# EAGLE design EveryCook_RaspiShield_V3 (EAGLE 6.4)
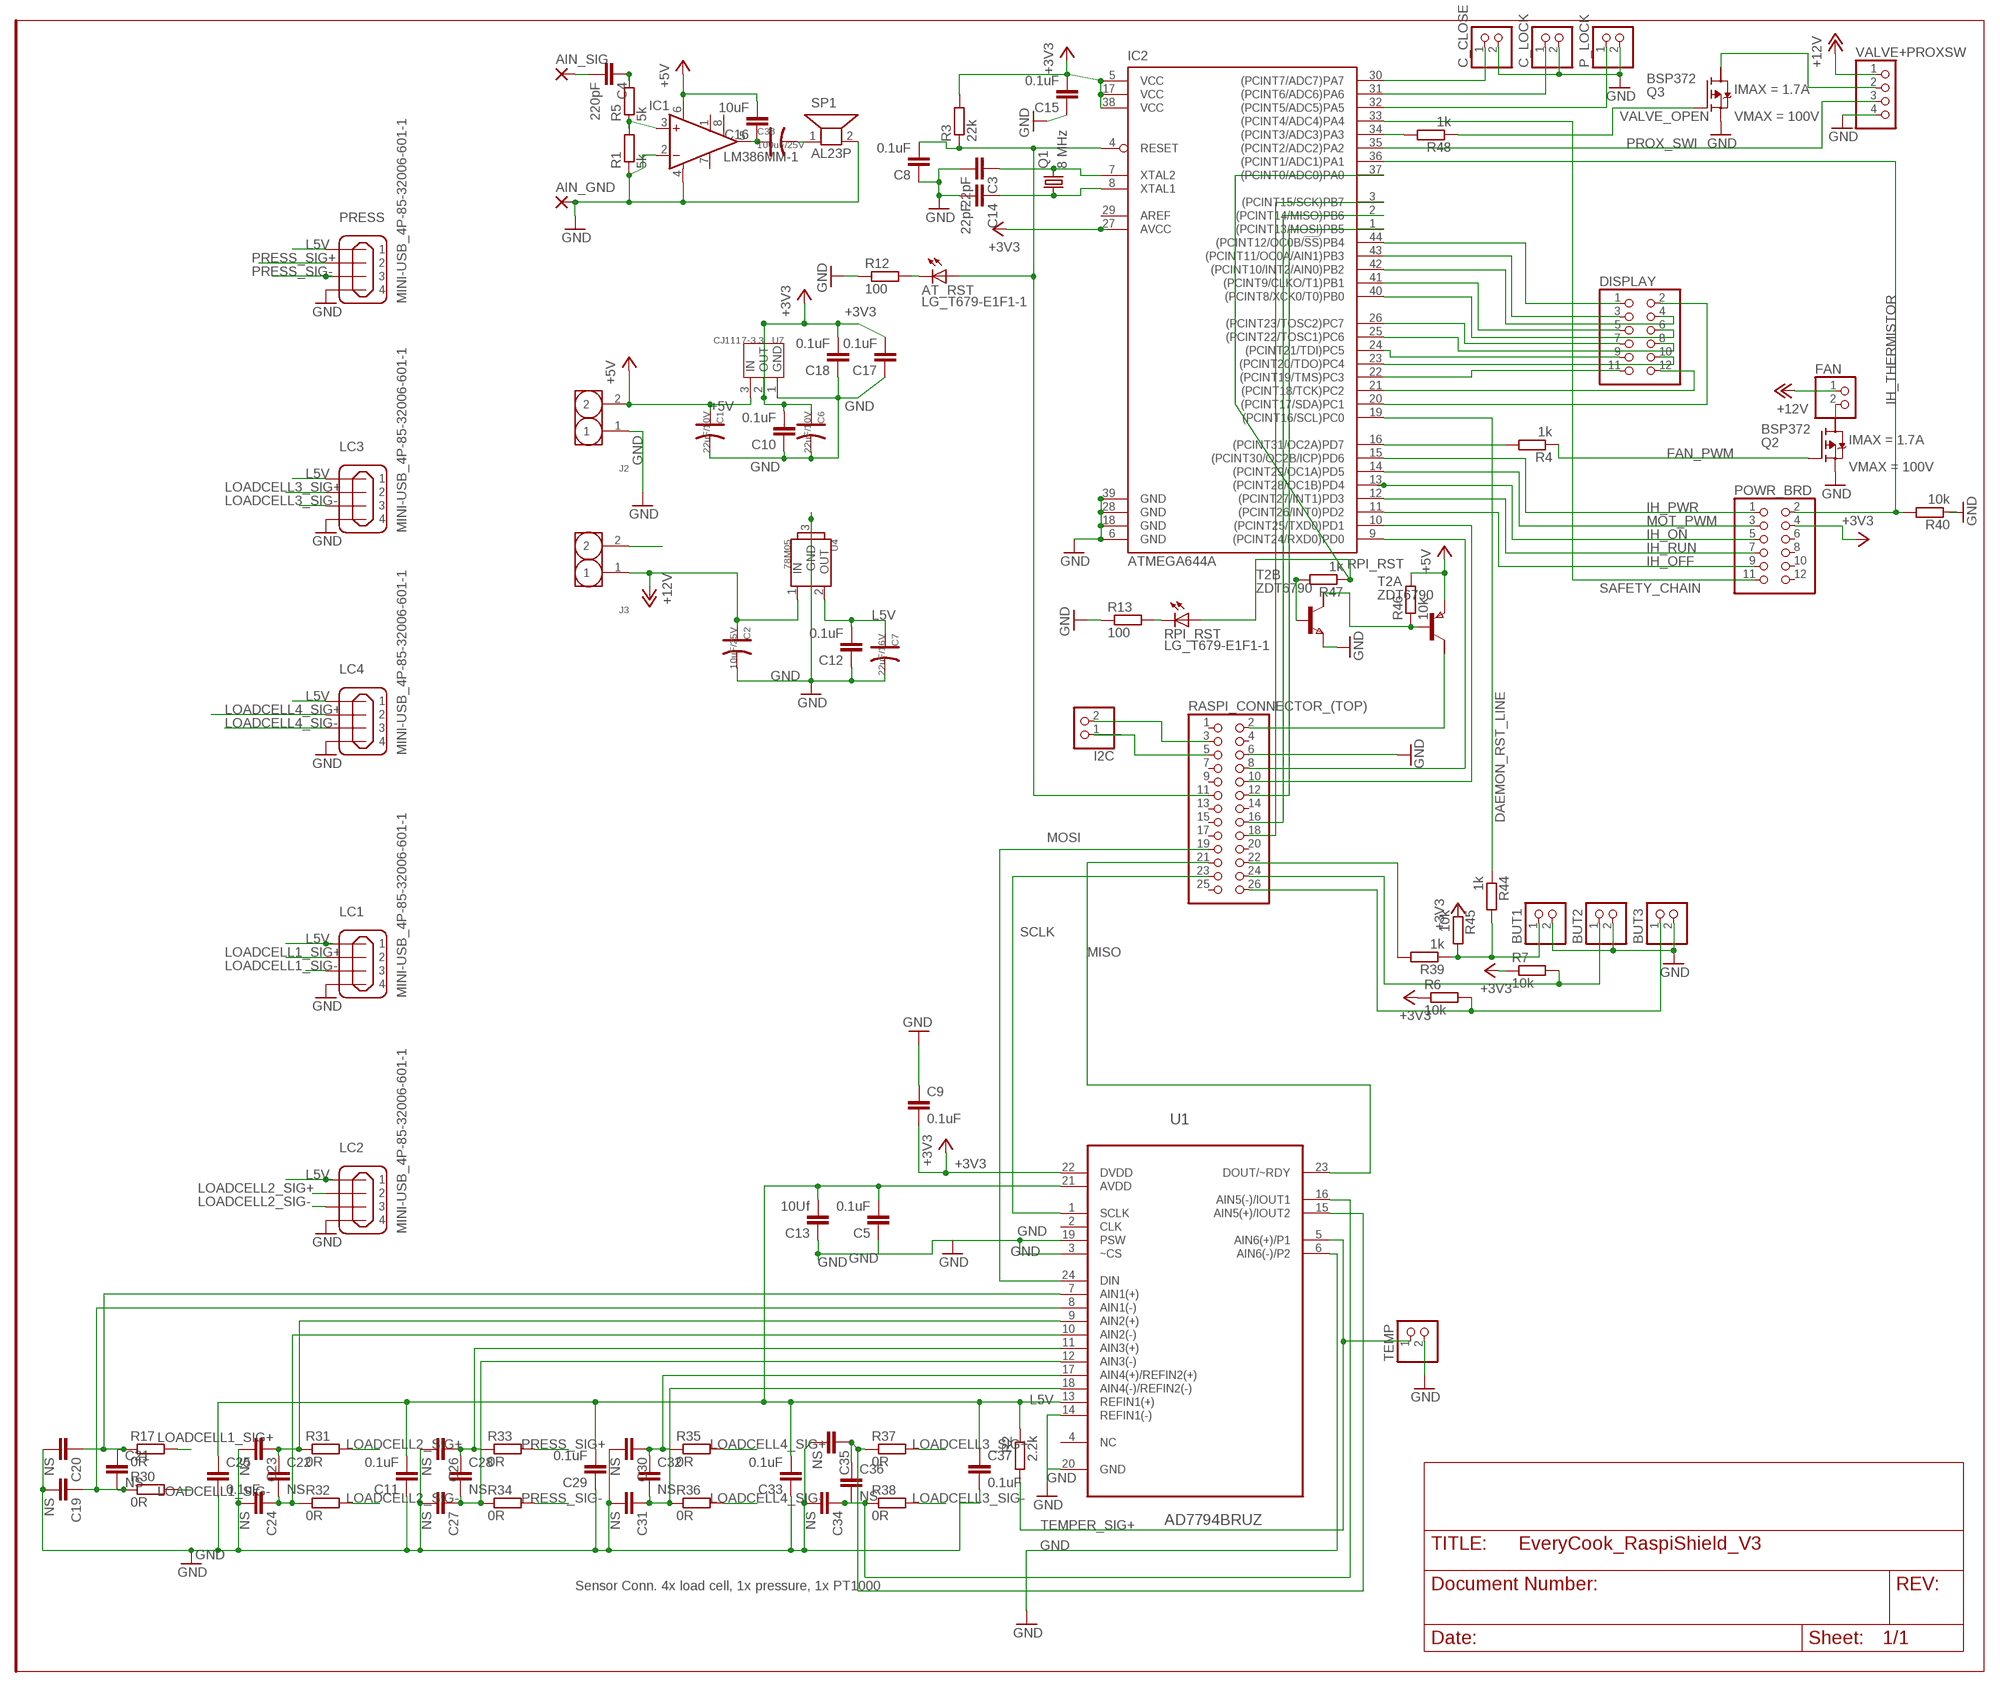
[diagram p0: schematic, sheet 1]

## Parts
AIN_GND  2,15/1,0  [2,15/1,0]
AIN_SIG  2,15/1,0  [2,15/1,0]
AT_RST  LG_T679-E1F1-1  [PLCC2]
BUT1  PINHD-1X2  [1X02]
BUT2  PINHD-1X2  [1X02]
BUT3  PINHD-1X2  [1X02]
C1  22uF/10V  CAP-AVX-A  [AVX-A]
C2  10uF/25V  CAP-ELECTRO-B  [ELECTRO-SMD-B-4.8MM]
C3  22pF  C-EUC0805  [C0805]
C4  220pF  C-EUC0805  [C0805]
C5  0.1uF  C-EUC0805  [C0805]
C6  22uF/10V  CAP-AVX-A  [AVX-A]
C7  22uF/16V  CAP-ELECTRO-B  [ELECTRO-SMD-B-4.8MM]
C8  0.1uF  C-EUC0805  [C0805]
C9  0.1uF  C-EUC0805  [C0805]
C10  0.1uF  C-EUC0805  [C0805]
C11  0.1uF  C-EUC0805  [C0805]
C12  0.1uF  C-EUC0805  [C0805]
C13  10Uf  C-EUC0805  [C0805]
C14  22pF  C-EUC0805  [C0805]
C15  0.1uF  C-EUC0805  [C0805]
C16  10uF  C-EUC0805  [C0805]
C17  0.1uF  C-EUC0805  [C0805]
C18  0.1uF  C-EUC0805  [C0805]
C19  NS  C-EUC0805  [C0805]
C20  NS  C-EUC0805  [C0805]
C21  NS  C-EUC0805  [C0805]
C22  NS  C-EUC0805  [C0805]
C23  NS  C-EUC0805  [C0805]
C24  NS  C-EUC0805  [C0805]
C25  0.1uF  C-EUC0805  [C0805]
C26  NS  C-EUC0805  [C0805]
C27  NS  C-EUC0805  [C0805]
C28  NS  C-EUC0805  [C0805]
C29  0.1uF  C-EUC0805  [C0805]
C30  NS  C-EUC0805  [C0805]
C31  NS  C-EUC0805  [C0805]
C32  NS  C-EUC0805  [C0805]
C33  0.1uF  C-EUC0805  [C0805]
C34  NS  C-EUC0805  [C0805]
C35  NS  C-EUC0805  [C0805]
C36  NS  C-EUC0805  [C0805]
C37  0.1uF  C-EUC0805  [C0805]
C38  100uF/25V  CAP-ELECTRO-B  [ELECTRO-SMD-B-4.8MM]
C_CLOSE  PINHD-1X2  [1X02]
C_LOCK  PINHD-1X2  [1X02]
DISPLAY  PINHD-2X6  [2X06]
FAN  PINHD-1X2  [1X02]
I2C  PINHD-1X2  [1X02]
IC1  LM386MM-1  [MMSOP08]
IC2  ATMEGA644A  [TQFP44]
J2  HEADER-2P-5.0  [2P-5.0]
J3  HEADER-2P-5.0  [2P-5.0]
LC1  MINI-USB_4P-85-32006-601-1  [85-32006-601-1]
LC2  MINI-USB_4P-85-32006-601-1  [85-32006-601-1]
LC3  MINI-USB_4P-85-32006-601-1  [85-32006-601-1]
LC4  MINI-USB_4P-85-32006-601-1  [85-32006-601-1]
P_LOCK  PINHD-1X2  [1X02]
POWR_BRD  PINHD-2X6  [2X06]
PRESS  MINI-USB_4P-85-32006-601-1  [85-32006-601-1]
Q1  8 MHz  CRYSTALHC49UP  [HC49UP]
Q2  BSP372  BSP613P  [PG-SOT-223]
Q3  BSP372  BSP613P  [PG-SOT-223]
R1  5k  R-EU_R0805  [R0805]
R2  2.2k  R-EU_R0805  [R0805]
R3  22k  R-EU_R0805  [R0805]
R4  1k  R-EU_R0805  [R0805]
R5  5k  R-EU_R0805  [R0805]
R6  10k  R-EU_R0805  [R0805]
R7  10k  R-EU_R0805  [R0805]
R12  100  R-EU_R0805  [R0805]
R13  100  R-EU_R0805  [R0805]
R17  0R  R-EU_R0805  [R0805]
R30  0R  R-EU_R0805  [R0805]
R31  0R  R-EU_R0805  [R0805]
R32  0R  R-EU_R0805  [R0805]
R33  0R  R-EU_R0805  [R0805]
R34  0R  R-EU_R0805  [R0805]
R35  0R  R-EU_R0805  [R0805]
R36  0R  R-EU_R0805  [R0805]
R37  0R  R-EU_R0805  [R0805]
R38  0R  R-EU_R0805  [R0805]
R39  1k  R-EU_R0805  [R0805]
R40  10k  R-EU_R0805  [R0805]
R44  1k  R-EU_R0805  [R0805]
R45  10k  R-EU_R0805  [R0805]
R46  10k  R-EU_R0805  [R0805]
R47  1k  R-EU_R0805  [R0805]
R48  1k  R-EU_R0805  [R0805]
RASPI_CONNECTOR_(TOP)  PINHD-2X13  [2X13]
RPI_RST  LG_T679-E1F1-1  [PLCC2]
SP1  AL23P  [AL23P]
T2  ZDT6790  NPN_PNPSM8  [SM8]
TEMP  PINHD-1X2  [1X02]
U1  AD7794BRUZ  [SOP65P640X120-24N]
U4  78M05  78M05-TO252  [TO252]
U7  CJ1117-3.3  LD1117SOT89  [SOT89]
VALVE+PROXSW  PINHD-1X4  [1X04]

## Nets
+3V3: C6.+ C9.2 C10.2 C15.2 C17.2 C18.2 IC2.5(VCC) IC2.17(VCC) IC2.27(AVCC) IC2.38(VCC) POWR_BRD.4 R3.2 R6.1 R7.1 R45.1 U1.22(DVDD) U7.2(OUT) U7.4(TAB)
+5V: C1.+ C16.2 IC1.6(VS) J2.2 R46.2 T2.1(A:E) U7.3(IN)
+12V: C2.+ FAN.1 J3.1 U4.1(IN) VALVE+PROXSW.1
ATMEL_RST: AT_RST.A C8.2 IC2.4(RESET) R3.1 RASPI_CONNECTOR_(TOP).11
DAEMON_RST_LINE: IC2.19((PCINT16/SCL)PC0) R44.1
FAN_PWM: Q2.1(G) R4.1
GND: AIN_GND.1(P) BUT1.2 BUT2.2 BUT3.2 C1.- C2.- C3.2 C5.1 C6.- C7.- C8.1 C9.1 C10.1 C11.1 C12.1 C13.1 C14.2 C15.1 C17.1 C18.1 C19.2 C20.2 C23.2 C24.2 C25.2 C26.2 C27.2 C29.1 C30.2 C31.2 C33.1 C34.2 C35.2 C37.2 C_CLOSE.2 C_LOCK.2 IC1.2(-IN) IC1.4(GND) IC2.6(GND) IC2.18(GND) IC2.28(GND) IC2.39(GND) J2.1 LC1.4 LC2.4 LC3.4 LC4.4 P_LOCK.2 PRESS.4 Q2.3(S) Q3.3(S) R1.1 R12.1 R13.1 R40.1 RASPI_CONNECTOR_(TOP).6 SP1.2 T2.3(B:E) TEMP.2 U1.3(~CS) U1.6(AIN6(-)/P2) U1.14(REFIN1(-)) U1.19(PSW) U1.20(GND) U4.3(GND) U7.1(GND) VALVE+PROXSW.4
IH_OFF: IC2.11((PCINT26/INT0)PD2) POWR_BRD.9
IH_ON: IC2.13((PCINT28/OC1B)PD4) POWR_BRD.5
IH_PWR: IC2.15((PCINT30/OC2B/ICP)PD6) POWR_BRD.1
IH_RUN: IC2.12((PCINT27/INT1)PD3) POWR_BRD.7
IH_THERMISTOR: IC2.36((PCINT1/ADC1)PA1) POWR_BRD.2 R40.2
L5V: C5.2 C7.+ C11.2 C12.2 C13.2 C25.1 C29.2 C33.2 C37.1 LC1.1 LC2.1 LC3.1 LC4.1 PRESS.1 R2.1 U1.13(REFIN1(+)) U1.21(AVDD) U4.2(OUT)
LOADCELL1_SIG+: LC1.2 R17.2
LOADCELL1_SIG-: LC1.3 R30.2
LOADCELL2_SIG+: LC2.2 R31.2
LOADCELL2_SIG-: LC2.3 R32.2
LOADCELL3_SIG+: LC3.2 R37.2
LOADCELL3_SIG-: LC3.3 R38.2
LOADCELL4_SIG+: LC4.2 R35.2
LOADCELL4_SIG-: LC4.3 R36.2
MISO: RASPI_CONNECTOR_(TOP).21 U1.23(DOUT/~RDY)
MOSI: RASPI_CONNECTOR_(TOP).19 U1.24(DIN)
MOT_PWM: IC2.14((PCINT29/OC1A)PD5) POWR_BRD.3
N$1: DISPLAY.2 IC2.20((PCINT17/SDA)PC1)
N$2: C3.1 IC2.7(XTAL2) Q1.2
N$3: C4.1 R5.2
N$5: C34.1 C36.2 R38.1 U1.16(AIN5(-)/IOUT1)
N$7: C14.1 IC2.8(XTAL1) Q1.1
N$8: IC2.3((PCINT15/SCK)PB7) RASPI_CONNECTOR_(TOP).18
N$9: C20.1 C21.1 R17.1 U1.7(AIN1(+))
N$10: IC2.16((PCINT31/OC2A)PD7) R4.2
N$11: DISPLAY.12 IC2.21((PCINT18/TCK)PC2)
N$12: I2C.2 RASPI_CONNECTOR_(TOP).3
N$14: IC1.3(+IN) R1.2 R5.1
N$15: DISPLAY.11 IC2.22((PCINT19/TMS)PC3)
N$16: DISPLAY.10 IC2.23((PCINT20/TDO)PC4)
N$17: DISPLAY.9 IC2.24((PCINT21/TDI)PC5)
N$18: DISPLAY.8 IC2.25((PCINT22/TOSC1)PC6)
N$19: DISPLAY.7 IC2.26((PCINT23/TOSC2)PC7)
N$22: C16.1 C38.+ IC1.5(OUT)
N$23: C38.- SP1.1
N$24: C22.1 C23.1 R31.1 U1.9(AIN2(+))
N$27: AIN_SIG.1(P) C4.2
N$32: AT_RST.C R12.2
N$34: R13.2 RPI_RST.C
N$37: DISPLAY.6 IC2.40((PCINT8/XCK0/T0)PB0)
N$38: DISPLAY.5 IC2.41((PCINT9/CLKO/T1)PB1)
N$39: DISPLAY.4 IC2.42((PCINT10/INT2/AIN0)PB2)
N$41: DISPLAY.3 IC2.43((PCINT11/OC0A/AIN1)PB3)
N$42: C22.2 C24.1 R32.1 U1.10(AIN2(-))
N$43: DISPLAY.1 IC2.44((PCINT12/OC0B/!SS!)PB4)
N$44: C27.1 C28.2 R34.1 U1.12(AIN3(-))
N$45: C30.1 C32.1 R35.1 U1.17(AIN4(+)/REFIN2(+))
N$46: C31.1 C32.2 R36.1 U1.18(AIN4(-)/REFIN2(-))
N$47: C35.1 C36.1 R37.1 U1.15(AIN5(+)/IOUT2)
N$48: C19.1 C21.2 R30.1 U1.8(AIN1(-))
N$50: I2C.1 RASPI_CONNECTOR_(TOP).5
N$51: FAN.2 Q2.2(D)
N$52: IC2.9((PCINT24/RXD0)PD0) RASPI_CONNECTOR_(TOP).8
N$53: C26.1 C28.1 R33.1 U1.11(AIN3(+))
N$54: IC2.10((PCINT25/TXD0)PD1) RASPI_CONNECTOR_(TOP).10
N$55: IC2.2((PCINT14/MISO)PB6) RASPI_CONNECTOR_(TOP).16
N$56: IC2.1((PCINT13/MOSI)PB5) RASPI_CONNECTOR_(TOP).12
N$58: RASPI_CONNECTOR_(TOP).2 T2.8(A:C1)
N$59: C_CLOSE.1 IC2.30((PCINT7/ADC7)PA7)
N$60: C_LOCK.1 IC2.31((PCINT6/ADC6)PA6)
N$61: IC2.32((PCINT5/ADC5)PA5) P_LOCK.1
N$62: BUT2.1 R7.2 RASPI_CONNECTOR_(TOP).24
N$63: BUT3.1 R6.2 RASPI_CONNECTOR_(TOP).26
N$64: R39.2 RASPI_CONNECTOR_(TOP).22
N$65: IC2.34((PCINT3/ADC3)PA3) R48.2
N$66: BUT1.1 R39.1 R44.2 R45.2
N$71: R47.2 T2.4(B:B)
N$72: R46.1 T2.2(A:B) T2.5(B:C1)
N$77: Q3.2(D) VALVE+PROXSW.2
PGND: J3.2
PRESS_SIG+: PRESS.2 R33.2
PRESS_SIG-: PRESS.3 R34.2
PROX_SWI: IC2.35((PCINT2/ADC2)PA2) VALVE+PROXSW.3
RPI_RST: IC2.37((PCINT0/ADC0)PA0) R47.1 RPI_RST.A
SAFETY_CHAIN: IC2.33((PCINT4/ADC4)PA4) POWR_BRD.11
SCLK: RASPI_CONNECTOR_(TOP).23 U1.1(SCLK)
TEMPER_SIG+: R2.2 TEMP.1 U1.5(AIN6(+)/P1)
VALVE_OPEN: Q3.1(G) R48.1
Unconnected: IC1.1(GAIN) IC1.7(BYPASS) IC1.8(GAIN) IC2.29(AREF) POWR_BRD.6 POWR_BRD.8 POWR_BRD.10 POWR_BRD.12 Q2.4(D) Q3.4(D) RASPI_CONNECTOR_(TOP).1 RASPI_CONNECTOR_(TOP).4 RASPI_CONNECTOR_(TOP).7 RASPI_CONNECTOR_(TOP).9 RASPI_CONNECTOR_(TOP).13 RASPI_CONNECTOR_(TOP).14 RASPI_CONNECTOR_(TOP).15 RASPI_CONNECTOR_(TOP).17 RASPI_CONNECTOR_(TOP).20 RASPI_CONNECTOR_(TOP).25 T2.6(B:C2) T2.7(A:C) U1.2(CLK) U1.4(NC)

## Notes on the sheet
- Sensor Conn. 4x load cell, 1x pressure, 1x PT1000

## Library data of the parts
AIN_GND AIN_SIG = wirepad:2,15/1,0: THROUGH-HOLE PAD
AT_RST RPI_RST = led:*_T679-?-1: LC TOPLED® Low Current LED Source: http://catalog.osram-os.com .. LG_LS_LY_T679_OBS.pdf; COLOR: green
BUT1-BUT3 C_CLOSE C_LOCK FAN I2C P_LOCK TEMP = pinhead:PINHD-1X2: PIN HEADER
C1 C2 C6 C7 C38 = Discrete:CAP*: Electrolytic Capacitors,Tantalum Capacitors and Super Capacitors
C3-C5 C8-C37 = rcl:C-EU: CAPACITOR, European symbol
DISPLAY POWR_BRD = pinhead:PINHD-2X6: PIN HEADER
IC1 = linear:LM386?-*: Low Voltage Audio Power Amplifier Source: http://cache.national.com/ds/LM/LM386.pdf
IC2 = atmel:ATMEGA644: 8-bit Microcontroller with 64K Bytes In-System Programmable Flash Source: http://www.atmel.com/dyn/resources/prod_documents/doc2593.pdf; MPN: ATMEGA644PV-10AU; OC_FARNELL: 1455123; OC_NEWARK: 58M3748
J2 J3 = Connector:HEADER-2P
LC1-LC4 PRESS = con-cypressindustries:MINI-USB_4P-: MINI USB 4 Pol. Source: www.cypressindustries.com; OC_FARNELL: unknown; OC_NEWARK: unknown
Q1 = crystal:CRYSTAL: CRYSTAL; OC_FARNELL: unknown; OC_NEWARK: unknown
Q2 Q3 = infineon:BSP613P: SIPMOS (R) Small-Signal-Transistor P-Channel (2 Drain) Source: http://www.infineon.com/dgdl/BSP613P_Rev2.4.pdf; IMAX: 1.7A; MF: Infineon; OC_FARNELL: unknown; OC_NEWARK: unknown; VMAX: 100V
R1-R7 R12 R13 R17 R30-R40 R44-R48 = rcl:R-EU_: RESISTOR, European symbol
RASPI_CONNECTOR_(TOP) = pinhead:PINHD-2X13: PIN HEADER
SP1 = buzzer:AL23P: SPEAKER Source: Buerklin; OC_FARNELL: unknown; OC_NEWARK: unknown
T2 = zetex:NPN_PNPSM8: Dual NPN TRANSISTOR; OC_FARNELL: unknown; OC_NEWARK: unknown
U1 = analog-devices:AD7794BRUZ: 6-Channel, Low Noise, Low Power, 24-/16-Bit Ó-Ä ADC with On-Chip In-Amp and Reference; MPN: AD7794BRUZ; OC_FARNELL: 1078329; OC_NEWARK: 19M0899; PACKAGE: TSSOP-24; SUPPLIER: Analog Devices
U4 = IC:78M05: 0.5A Three Terminal Positive Voltage Regulators http://pdf1.alldatasheet.com/datasheet-pdf/view/31368/TOSHIBA/78M05/+21_79UPLRhpDDdCDytD+/datasheet.pdf
U7 = IC:LD1117: Low Drop Fixed And Adjustable Positive Voltage Regulators http://www.datasheetcatalog.org/datasheet/SGSThomsonMicroelectronics/mXuqtqv.pdf
VALVE+PROXSW = pinhead:PINHD-1X4: PIN HEADER

## Board
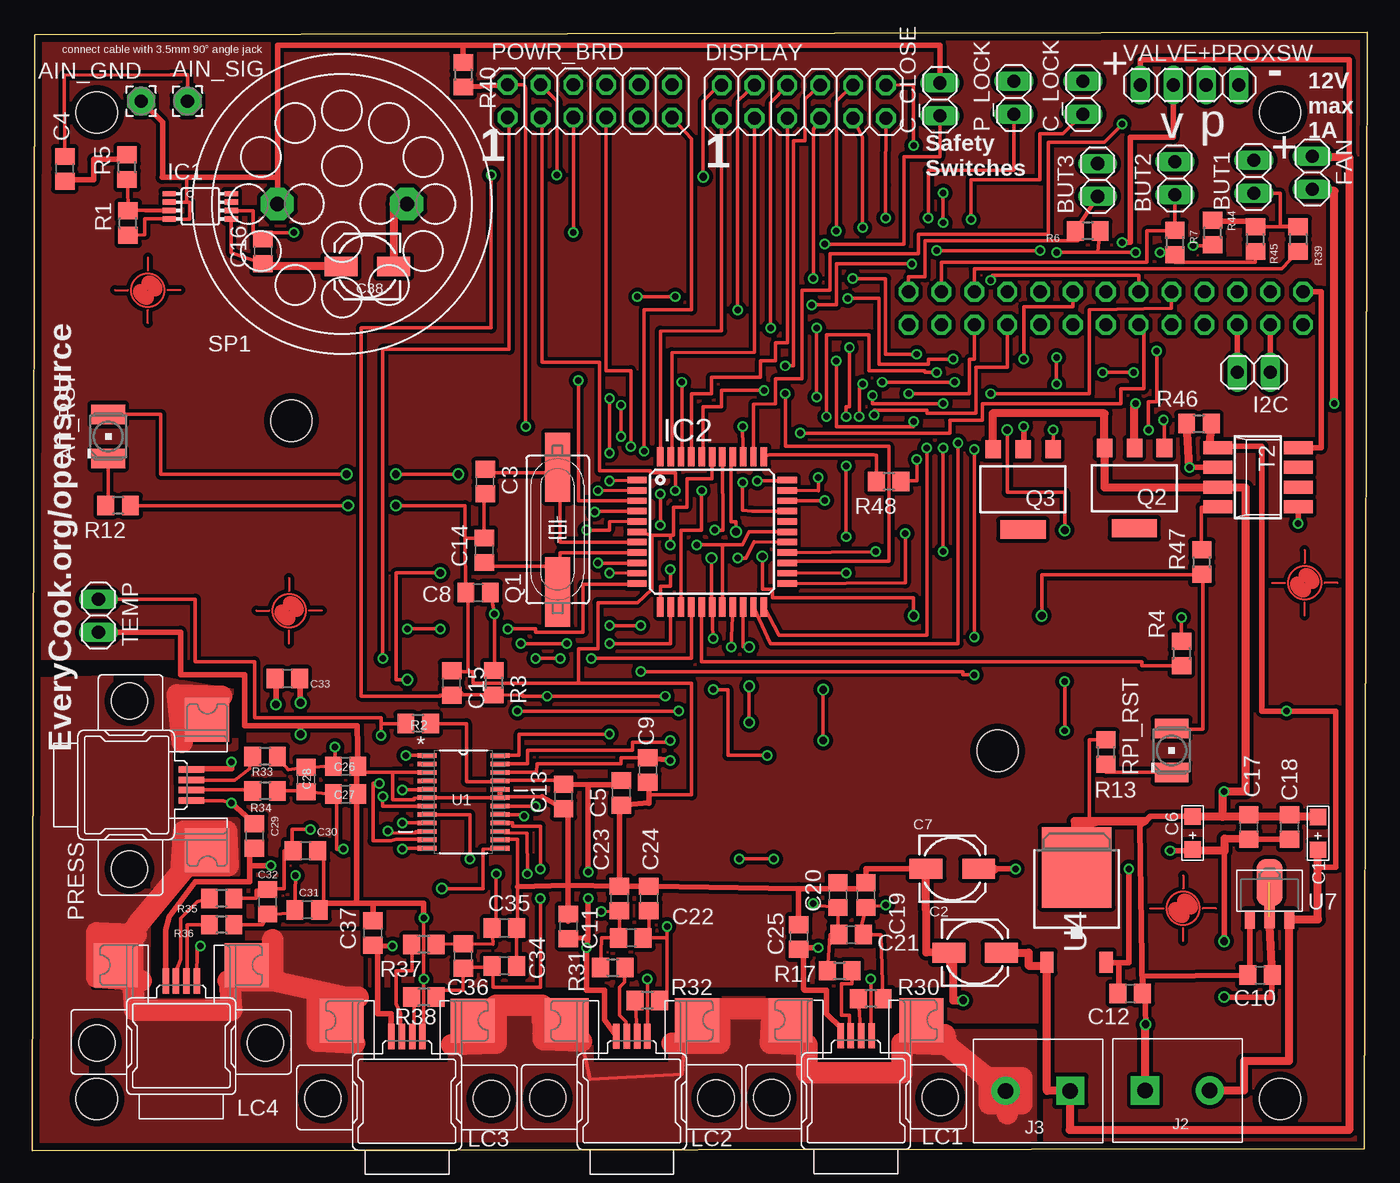
[diagram p1: board, top side]
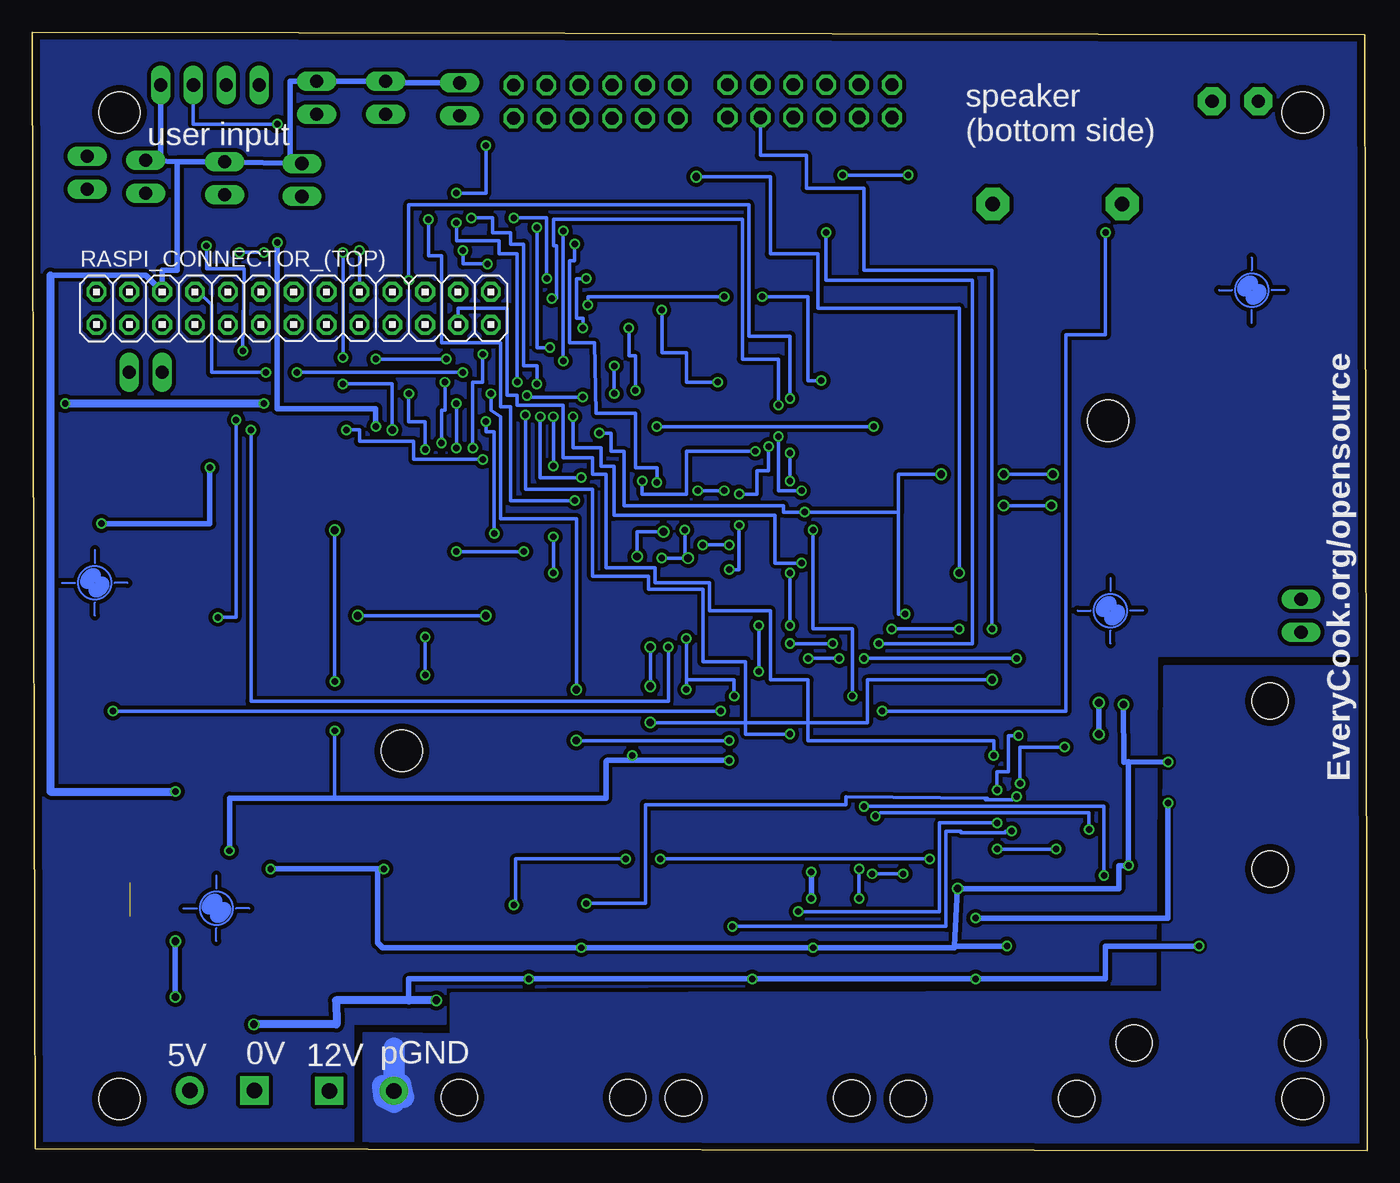
[diagram p2: board, bottom side, seen from below]

Size 103.15 x 86.39 mm. Coordinates in mm from the lower left corner, seen from the top.
Outline: 0.2,86.18 103.15,86.39 102.92,0.13 0,0 0.2,86.18
Copper layers (1*16): Top 0.035mm / dielectric 1.5mm / Bottom 0.035mm
Design rules "default *": minimum track width 7mil, minimum drill 12mil, track to track 8mil, track to pad 8mil, pad to pad 8mil, via to via 8mil, smd to smd 0mil, copper to edge 20mil, drill to drill 10mil, minimum pad ring 10mil, minimum via ring 6mil, stop-mask expansion 2mil, vias tented up to drill 25mil, thermal gap 10mil
Holes 3.2 mm at 74.6,30.89 20.02,56.39 4.98,80.19 4.98,3.99 96.42,3.99 96.42,80.19

### Footprints (pad centres in the part's own frame; a part is rotated, then mirrored left to right if it is on the bottom)
2,15/1,0 = drill 1.016 pad 2.159 octagon: 1 0,0
PLCC2 = smd 2.6 x 1.5: A 0,1.7; C 0,-1.7
1X02 = drill 1.016 long: 1 -1.27,0; 2 1.27,0
AVX-A = smd 1.27 x 1.27: + -1.27,0; - 1.27,0
ELECTRO-SMD-B-4.8MM = smd 2.54 x 1.524: + 2.032,0; - -2.032,0
C0805 = smd 1.3 x 1.5: 1 -0.95,0; 2 0.95,0
2X06 = drill 1.016 octagon: 1 -6.35,-1.27; 2 -6.35,1.27; 3 -3.81,-1.27; 4 -3.81,1.27; 5 -1.27,-1.27; 6 -1.27,1.27; 7 1.27,-1.27; 8 1.27,1.27; 9 3.81,-1.27; 10 3.81,1.27; 11 6.35,-1.27; 12 6.35,1.27
MMSOP08 = smd 0.41 x 1.02: 1 -0.975,-2.4; 2 -0.325,-2.4; 3 0.325,-2.4; 4 0.975,-2.4; 5 0.975,2.4; 6 0.325,2.4; 7 -0.325,2.4; 8 -0.975,2.4
TQFP44 = smd 1.5 x 0.5: 1 -5.8,4; 2 -5.8,3.2; 3 -5.8,2.4; 4 -5.8,1.6; 5 -5.8,0.8; 6 -5.8,0; 7 -5.8,-0.8; 8 -5.8,-1.6; 9 -5.8,-2.4; 10 -5.8,-3.2; 11 -5.8,-4; 23 5.8,-4; 24 5.8,-3.2; 25 5.8,-2.4; 26 5.8,-1.6; 27 5.8,-0.8; 28 5.8,0; 29 5.8,0.8; 30 5.8,1.6; 31 5.8,2.4; 32 5.8,3.2; 33 5.8,4 | smd 0.5 x 1.5: 12 -4,-5.8; 13 -3.2,-5.8; 14 -2.4,-5.8; 15 -1.6,-5.8; 16 -0.8,-5.8; 17 0,-5.8; 18 0.8,-5.8; 19 1.6,-5.8; 20 2.4,-5.8; 21 3.2,-5.8; 22 4,-5.8; 34 4,5.8; 35 3.2,5.8; 36 2.4,5.8; 37 1.6,5.8; 38 0.8,5.8; 39 0,5.8; 40 -0.8,5.8; 41 -1.6,5.8; 42 -2.4,5.8; 43 -3.2,5.8; 44 -4,5.8
2P-5.0 = drill 1.2 pad 2.184 square: 1 0,0 | drill 1.2 pad 2.184: 2 5,0
85-32006-601-1 = smd 0.5 x 1.95: 1 -1.2,4.775; 2 -0.4,4.775; 3 0.4,4.775; 4 1.2,4.775 | smd 3.4 x 3.4: M1 -5.05,6; M2 5.05,6 | hole 2.8: -6.5,0; 6.5,0
HC49UP = smd 5.334 x 1.93: 1 -4.826,0; 2 4.826,0
PG-SOT-223 = smd 1.2 x 1.4: 1 -2.311,-3.099; 2 0,-3.099; 3 2.311,-3.099 | smd 3.5 x 1.4: 4 0,3.099
R0805 = smd 1.3 x 1.5: 1 -0.95,0; 2 0.95,0
2X13 = drill 1.016 octagon: 1 -15.24,-1.27; 2 -15.24,1.27; 3 -12.7,-1.27; 4 -12.7,1.27; 5 -10.16,-1.27; 6 -10.16,1.27; 7 -7.62,-1.27; 8 -7.62,1.27; 9 -5.08,-1.27; 10 -5.08,1.27; 11 -2.54,-1.27; 12 -2.54,1.27; 13 0,-1.27; 14 0,1.27; 15 2.54,-1.27; 16 2.54,1.27; 17 5.08,-1.27; 18 5.08,1.27; 19 7.62,-1.27; 20 7.62,1.27; 21 10.16,-1.27; 22 10.16,1.27; 23 12.7,-1.27; 24 12.7,1.27; 25 15.24,-1.27; 26 15.24,1.27
AL23P = drill 1.118 pad 2.54 octagon: 1 -5.004,0; 2 5.004,0
SM8 = smd 1.016 x 2.235: 1 -2.286,-3.099; 2 -0.762,-3.099; 3 0.762,-3.099; 4 2.286,-3.099; 5 2.286,3.099; 6 0.762,3.099; 7 -0.762,3.099; 8 -2.286,3.099
SOP65P640X120-24N = smd 1.473 x 0.356: 1 -2.819,3.581; 2 -2.819,2.921; 3 -2.819,2.286; 4 -2.819,1.626; 5 -2.819,0.965; 6 -2.819,0.33; 7 -2.819,-0.33; 8 -2.819,-0.965; 9 -2.819,-1.626; 10 -2.819,-2.286; 11 -2.819,-2.921; 12 -2.819,-3.581; 13 2.819,-3.581; 14 2.819,-2.921; 15 2.819,-2.286; 16 2.819,-1.626; 17 2.819,-0.965; 18 2.819,-0.33; 19 2.819,0.33; 20 2.819,0.965; 21 2.819,1.626; 22 2.819,2.286; 23 2.819,2.921; 24 2.819,3.581
TO252 = smd 1.016 x 1.651: 1 -2.286,-4.826; 2 2.286,-4.826 | smd 5.4 x 6.2: 3 0,2.5
SOT89 = smd 0.8 x 1.4: 1 -1.524,-1.905; 3 1.524,-1.905 | smd 0.8 x 1.9: 2 0,-1.651 | smd 2.032 x 3.65: 4 0,0.94
1X04 = drill 1.016 long: 1 -3.81,0; 2 -1.27,0; 3 1.27,0; 4 3.81,0

### Placement (x,y rotation side)
AIN_GND  8.41,81.08 180 top
AIN_SIG  11.99,81.08 180 top
AT_RST  5.87,55.17 0 top
BUT1  94.39,75.23 90 top
BUT2  88.29,75.11 90 top
BUT3  82.32,74.98 90 top
C1  99.34,24.51 90 top
C2  72.85,15.29 0 top
C3  35,51.69 270 top
C4  2.51,75.84 90 top
C5  45.51,27.64 90 top
C6  89.66,24.54 90 top
C7  71.09,21.77 0 top
C8  34.44,43.1 0 top
C9  47.57,29.4 90 top
C10  94.87,13.56 0 top
C11  41.43,17.32 270 top
C12  84.84,12.14 180 top
C13  41.05,27.36 90 top
C14  34.93,46.38 90 top
C15  32.41,36.12 270 top
C16  17.83,69.47 90 top
C17  94.01,24.99 270 top
C18  97.16,24.99 270 top
C19  64.41,19.74 90 top
C20  62.26,19.74 90 top
C21  63.27,16.69 0 top
C22  46.25,16.43 0 top
C23  45.36,19.48 90 top
C24  47.65,19.48 90 top
C25  59.23,16.51 90 top
C26  24.21,29.69 0 top
C27  24.21,27.53 0 top
C28  21.16,28.68 270 top
C29  17.17,24.31 270 top
C30  21.11,23.16 0 top
C31  21.23,18.59 0 top
C32  18.19,19.23 270 top
C33  19.71,36.47 180 top
C34  36.47,14.27 0 top
C35  36.47,17.2 0 top
C36  33.3,15.04 270 top
C37  26.31,16.81 90 top
C38  25.88,68.3 180 top
C_CLOSE  70.13,81.2 90 top
C_LOCK  81.18,81.33 90 top
DISPLAY  59.61,81.03 0 top
FAN  98.91,75.54 270 top
I2C  94.39,60.12 0 top
IC1  12.98,72.95 270 top
IC2  52.53,47.8 0 top
J2  85.99,4.65 0 top
J3  80.21,4.62 180 top
LC1  63.65,4.09 0 top
LC2  46.33,4.06 0 top
LC3  28.96,4.04 0 top
LC4  11.51,8.33 0 top
P_LOCK  75.84,81.33 90 top
POWR_BRD  43.08,81.08 0 top
PRESS  7.52,28.24 270 top
Q1  40.59,47.98 90 top
Q2  85.17,51.18 180 top
Q3  76.56,51.08 180 top
R1  7.39,71.65 90 top
R2  29.82,32.99 180 top
R3  35.66,36.14 270 top
R4  88.8,38.4 270 top
R5  7.32,75.97 90 top
R6  81.56,71.04 180 top
R7  88.29,70.15 90 top
R12  6.63,49.83 180 top
R13  82.96,30.78 270 top
R17  62.38,13.89 0 top
R30  64.8,11.73 180 top
R31  44.86,14.15 0 top
R32  47.52,11.61 180 top
R33  17.98,30.45 180 top
R34  17.98,27.79 180 top
R35  14.63,19.48 180 top
R36  14.63,17.45 180 top
R37  30.25,15.93 180 top
R38  30.25,11.86 180 top
R39  97.82,70.41 270 top
R40  33.3,83.11 270 top
R44  91.21,70.92 90 top
R45  94.51,70.41 90 top
R46  90.14,56.16 0 top
R47  90.37,45.47 90 top
R48  66.18,51.69 180 top
RASPI_CONNECTOR_(TOP)  82.96,65.07 0 bottom
RPI_RST  88.04,30.91 0 top
SP1  23.93,73.13 180 top
T2  94.72,52.02 270 top
TEMP  5.11,41.33 270 top
U1  33.32,26.94 0 top
U4  80.7,19.38 0 top
U7  95.61,19.76 0 top
U$1  [PASS-ROUND]  8.92,66.47 0 top
U$2  [PASS-ROUND]  19.84,41.71 0 top
U$3  [PASS-ROUND]  88.93,18.72 0 top
U$4  [PASS-ROUND]  98.32,43.87 0 top
VALVE+PROXSW  89.43,82.32 0 top

### Tracks (layer width: path | path; a pad name or v marks a point on that pad's centre or on a via)
+3V3  (via drill 0.5 pad 0.25, 0.6, 0.6 pad 0.25)  (1 unrouted)
  Top 0.254: POWR_BRD.4 40.54,81.08 v40.54,75.36 | v35.46,75.36 35.46,63.55 25.43,63.55 25.43,35.1 31.52,35.1 31.52,35.17 C15.2 32.41,35.38 33.17,35.38 33.17,35.23 34.82,35.23 34.82,35.19 R3.2 37.87,35.23 37.87,35.1 v39.78,35.1 v48.92,35.1 | R45.1 94.51,68.63 88.29,68.63 R7.1 v87.15,69.39 | v85.24,69.39 82.32,69.39 | R6.1 82.32,69.39 | 82.32,69.39 v79.15,69.39 | v79.15,61.26 v79.15,59.23 | v75.34,55.68 75.34,50.85 79.78,50.85 v79.78,47.93 | v79.78,36.25 v79.78,32.44 | IC2.17 v52.6,39.55 | v52.6,35.61 53.75,35.61 53.75,30.53 v56.79,30.53 | v54.51,45.77 55.14,45.77 55.78,47.04 IC2.27 | IC2.5 44.6,48.56 44.6,47.93 v42.82,47.93 | U1.22 38.98,29.22 39.01,29.9 45.49,29.9 45.49,30.35 C9.2 | IC2.38 53.37,47.93 v52.73,47.93 | IC2.17 52.6,42 | IC2.17 52.48,42 v52.48,45.77
  Top 0.406: C6.+ 89.56,23.16 v87.91,23.16 | v49.3,30.15 v49.29,30.16 C9.2 | C17.2 C18.2 | 92.13,23.16 92.1,23.16 v92.1,16.18 | v92.1,11.86 95.76,11.86 C10.2
  Top 0.61: C10.2 U7.2 | C17.2 92.13,24.1 92.13,23.16 89.66,23.16 C6.+
  Bottom 0.254: v40.54,75.36 v35.46,75.36 | v87.15,69.39 v85.24,69.39 | v79.15,69.39 v79.15,61.26 | v79.15,59.23 75.34,59.23 v75.34,55.68 | v79.78,47.93 v79.78,36.25 | v79.78,32.44 79.78,27.23 | v52.6,39.55 52.6,36.37 | 52.6,36.37 v52.6,35.61 | v56.79,30.53 56.79,30.15 52.6,30.15 | v42.82,47.93 42.82,40.31 39.78,40.31 v39.78,35.1 | 52.6,36.37 48.92,36.37 v48.92,35.1 | v52.48,45.77 v54.51,45.77 52.73,45.77 v52.73,47.93
  Bottom 0.406: v87.91,23.16 87.91,27.23 79.78,27.23 58.83,27.23 58.83,30.02 58.7,30.15 52.6,30.15 v49.3,30.15 | v92.1,16.18 v92.1,11.86
+5V  (via drill 0.5 pad 0.25)
  Top 0.254: IC1.6 17.07,72.62 17.07,70.87 C16.2 18.26,70.92 v20.22,70.92 | v37.49,33.96 v49.94,33.96
  Top 0.406: T2.1 91.62,54.41 95.02,54.41 95.02,33.96 v96.93,33.96 100.74,33.96 100.74,21.89 99.34,21.89
  Top 0.61: J2.2 93.65,4.65 93.65,6.93 97.13,6.93 U7.3 99.34,17.86 99.34,21.89 C1.+ | R46.2 90.91,54.3 T2.1
  Bottom 0.254: v20.22,70.92 20.22,63.04 23.27,63.04 23.27,33.96 v37.49,33.96 | v49.94,33.96 v96.93,33.96
+12V
  Top 0.406: FAN.1 98.93,76.76 | 80.16,1.57 80.21,1.75 | VALVE+PROXSW.1 85.62,84.25 101.75,84.25 101.75,76.76
  Top 0.61: C2.+ 76.99,15.29 76.99,14.3 78.41,14.3 U4.1 78.41,4.62 J3.1 80.21,1.75 | 98.93,76.76 101.75,76.76 101.75,1.57 80.16,1.57
ATMEL_RST  (via drill 0.5 pad 0.25, 0.6)
  Top 0.254: R3.1 35.71,36.96 v35.71,41.45 C8.2 | v43.46,49.33 43.92,49.4 IC2.4 | RASPI_CONNECTOR_(TOP).11 85.88,63.55 85.88,58.85 84.1,58.85 84.1,57.71 73.43,57.71 73.43,56.44 70.89,56.44 70.89,55.42 v59.33,55.42 | AT_RST.A 9.93,56.87 9.93,52.25 v24.28,52.25 | v28.09,52.25 v32.92,52.25
  Bottom 0.254: v35.71,41.45 36.22,41.45 36.22,49.33 | 36.22,49.33 v43.46,49.33 45.11,49.33 45.11,49.83 57.43,49.83 57.43,54.03 58.45,54.03 58.45,55.42 v59.33,55.42 | v24.28,52.25 v28.09,52.25 | v32.92,52.25 36.22,52.25 36.22,49.33
DAEMON_RST_LINE  (via drill 0.5 pad 0.25)
  Top 0.254: R44.1 90.96,69.9 v89.69,69.9 | v86.89,61.77 86.89,57.84 86.26,57.84 v86.26,55.68 | v54,38.91 IC2.19
  Bottom 0.254: v89.69,69.9 89.69,68.12 86.77,68.12 v86.89,61.77 | v86.26,55.68 86.26,34.72 54,34.72 v54,38.91
FAN_PWM  (via drill 0.5 pad 0.25)
  Top 0.254: Q2.1 87.48,56.44 v87.4,56.44 | v88.8,41.2 R4.1
  Bottom 0.254: v87.4,56.44 87.4,41.2 v88.8,41.2
GND  (via drill 0.5, 0.5 pad 0.25, 0.6)
  Top 0.254: SP1.2 18.95,73.13 | 11.94,75.21 11.94,73.25 | 11.94,73.25 10.58,73.25 IC1.2 | 11.94,73.25 12.17,73.25 12.17,71.96 10.58,71.96 IC1.4 8.69,71.97 8.69,70.76 R1.1 | LC1.4 64.8,8.86 v64.8,13.26 | LC2.4 v47.52,13.26 | LC3.4 30.25,8.81 v30.25,13.26 v30.25,17.96 | LC4.4 12.73,15.77 v12.98,15.8 | PRESS.4 14.76,27.04 v15.39,26.85 | C34.2 C35.2 37.49,17.07 37.49,20.37 37.49,24.05 36.14,24.05 U1.14 | 63.91,20.24 C19.2 | C31.2 21.87,19.1 | 25.04,29.36 C26.2 25.18,29.22 | 25.18,29.22 27.84,29.22 | U1.3 27.84,29.22 | 27.84,29.22 27.84,27.1 29.36,27.09 29.49,27.09 29.49,27.23 U1.6 U1.19 | 39.4,27.36 35.97,27.36 | 34.87,50.57 C3.2 34.93,50.93 C14.2 34.67,47.29 33.43,47.29 | 33.68,37.01 34.06,37.01 34.06,36.12 42.19,36.12 | 42.19,36.12 50.95,36.12 50.95,27.48 47.65,27.48 | 33.43,47.29 C8.1 33.68,43.1 33.68,37.01 | 33.68,37.01 33.3,37.01 C15.1 | IC2.6 47.9,47.55 | 47.9,47.55 47.9,43.36 46.76,42.34 43.71,42.34 43.71,38.79 42.19,38.79 42.19,36.12 | IC2.39 52.53,51.92 50.57,51.92 50.57,49.71 49.56,49.71 49.56,47.55 49.3,47.55 | 49.3,47.55 47.9,47.55 | IC2.18 53.33,46.79 | 53.33,46.79 54.89,46.79 55.4,47.8 IC2.28 | 53.33,46.79 v51.33,46.79 | v49.3,46.79 49.3,47.55 | 25.18,29.22 25.04,29.13 C27.2 | R13.1 81.67,31.73 81.67,25.43 | R12.1 v24.41,49.83 | v28.09,49.83 33.43,49.83 33.43,47.29 | C30.2 22.5,23.16 22.5,19.1
  Top 0.406: U1.19 U1.20 | 18.95,73.13 18.95,75.21 | 18.95,75.21 12.32,75.21 | 12.32,75.21 11.94,75.21 | 12.32,75.21 10.03,75.18 10.06,75.18 10.06,79.43 AIN_GND.1 | C23.2 41.4,20.5 | 41.4,20.5 37.49,20.37 | C23.2 C24.2 59.21,20.24 | 59.21,20.24 62.76,20.24 | 62.76,20.24 63.91,20.24 | C7.- 64.41,21.77 C19.2 | 21.87,19.1 22.5,19.1 25.04,19.1 | 25.04,19.1 26.31,19.1 | 26.31,19.1 30.25,19.1 v30.25,17.96 | 25.04,29.36 25.04,29.13 25.04,19.1 | TEMP.2 11.46,40.06 11.46,36.75 16.41,36.75 16.41,32.82 20.73,32.82 | 20.73,32.82 25.1,32.82 C26.2 | C25.2 59.21,17.55 59.21,20.24 | C11.1 41.4,17.73 41.4,20.5 | C29.1 v15.39,26.85 | C37.2 26.31,19.1 | v20.73,32.16 20.73,32.82 | 41.4,20.5 41.4,26.11 C13.1 39.4,27.36 | C23.2 45.36,26.73 C5.1 47.62,26.88 47.65,26.85 47.65,27.48 47.65,28.55 C9.1 | v86.03,9.75 85.98,12.09 C12.1 | C12.1 85.8,13.49 C10.1 94.08,13.87 U7.1 | 94.01,25.78 93.95,25.83 86.39,25.83 86,25.45 85.6,25.04 C12.1 | 18.95,75.21 18.95,85.39 33.3,85.39 | 33.3,85.39 70.13,85.39 C_CLOSE.2 70.26,82.6 | R40.1 33.3,85.39 | 93.75,51.23 T2.3 | C1.- C18.1 | C20.2 62.76,20.24 | U4.3 81.05,25.07 | C33.1 20.66,36.25 v20.73,34.59
  Top 0.61: C1.- 94.01,25.78 | 94.01,25.78 C17.1 | 94.01,25.78 91.97,25.78 | 91.97,25.78 89.66,25.78 C6.- | 86.06,4.65 J2.1 85.99,9.71 v86.03,9.75 | C2.- 70.94,14.3 | C2.- 71.15,14.78 71.15,11.61 v71.93,11.61 | C2.- 69.09,15.32 C7.- 69.29,21.79 | 91.97,25.78 91.97,27.61 v92.1,27.74 93.75,27.74 93.75,51.23 82.86,51.23 Q2.3 82.86,56.95 74.19,56.95 74.19,54.18 Q3.3 | 80.92,25.07 81.05,25.07 82.32,25.45 86,25.45 81.67,25.43 80.54,25.45 80.54,24.31
  Bottom 0.254: v51.33,46.79 v49.3,46.79 | v24.41,49.83 v28.09,49.83
  Bottom 0.406: 74.07,11.61 74.07,13.26 v64.8,13.26 v47.52,13.26 v30.25,13.26 20.22,13.26 20.22,15.8 v12.98,15.8 | v15.39,26.85 15.39,17.96 v30.25,17.96 | v20.73,34.59 v20.73,32.16 | 91.97,76.38 BUT1.2 93.24,76.76 VALVE+PROXSW.4 | 91.97,76.38 BUT2.2 BUT3.2 83.21,76.25 83.21,82.6 C_LOCK.2 P_LOCK.2 75.72,82.47 C_CLOSE.2 | 91.97,76.38 91.97,68 93.12,68 RASPI_CONNECTOR_(TOP).6 94.39,67.61 101.75,67.61
  Bottom 0.61: v71.93,11.61 74.07,11.61 79.68,11.61 79.65,9.75 v86.03,9.75 86.06,9.73 | 101.75,67.61 101.75,27.74 v92.1,27.74
IH_OFF  (via drill 0.5 pad 0.25)
  Top 0.254: v28.98,40.31 v31.52,40.31 | v36.73,40.31 38.89,40.31 38.89,40.06 42.57,40.06 42.57,43.74 46.66,43.74 IC2.11
  Bottom 0.254: POWR_BRD.9 46.89,76.89 43.33,76.89 43.33,74.35 38.89,74.35 38.89,68 28.98,68 v28.98,40.31 | v31.52,40.31 v36.73,40.31
IH_ON  (via drill 0.5 pad 0.25)
  Top 0.254: POWR_BRD.5 v41.81,70.92 | v37.74,39.17 v41.3,39.17 | v44.6,39.17 49.3,39.17 49.3,42 IC2.13
  Bottom 0.254: v41.81,70.92 41.81,67.23 30.51,67.23 30.51,39.17 v37.74,39.17 | v41.3,39.17 v44.6,39.17
IH_PWR  (via drill 0.5 pad 0.25)
  Top 0.254: POWR_BRD.1 36.86,79.68 36.86,61.9 27.08,61.9 v27.08,38.02 | v38.89,38.02 v40.79,38.02 | v43.21,38.02 50.95,38.02 50.95,38.53 50.93,38.56 IC2.15
  Bottom 0.254: v27.08,38.02 v38.89,38.02 | v40.79,38.02 v43.21,38.02
IH_RUN  (via drill 0.5 pad 0.25)
  Top 0.254: POWR_BRD.7 44.35,60.25 46.25,60.25 v46.25,54.41 | v48.54,50.72 v48.54,48.31 | v49.3,44.88 49.3,43.61 48.54,43.61 IC2.12
  Bottom 0.254: v46.25,54.41 46.25,52.5 47.14,52.5 47.14,50.72 v48.54,50.72 | v48.54,48.31 48.54,44.88 v49.3,44.88
IH_THERMISTOR  (via drill 0.5 pad 0.25)
  Top 0.254: POWR_BRD.2 38,82.35 38.13,82.09 v38.13,55.93 | v54.89,55.93 54.93,54.24 IC2.36
  Top 0.406: R40.2 POWR_BRD.2
  Bottom 0.254: v38.13,55.93 v54.89,55.93
L5V  (via drill 0.5 pad 0.25, 0.6)
  Top 0.254: R2.1 33.55,32.99 33.55,28.5 36.14,28.5 U1.21 36.2,28.63 40.54,28.63 C13.2 | LC1.1 62.51,9.45 | 27.71,9.32 LC3.1 | U1.13 34.82,23.29 34.82,20.24 v31.65,20.24
  Top 0.406: U4.2 83.01,14.53 83.97,14.53 | 83.97,14.53 84.73,14.53 v84.73,21.77 | v75.97,21.77 74.37,21.77 | 62.51,9.45 61.37,10.59 61.37,12.37 59.72,12.37 59.59,12.5 59.59,15.6 C25.1 59.66,15.67 v60.73,15.67 | LC2.1 44.22,10.13 44.22,12.37 42.82,12.37 v42.82,15.67 42.95,16.43 | C11.2 42.95,16.43 | 42.82,16.56 42.95,16.43 | LC4.1 10.31,13.62 10.31,17.07 10.57,18.08 12.6,20.75 16.79,20.75 16.79,22.02 | 27.71,9.32 27.71,10.59 26.7,10.59 26.7,15.86 C37.1 v27.84,15.8 | PRESS.1 12.36,29.51 15.39,29.51 v15.39,30.02 | C13.2 42.95,28.24 | 42.95,28.24 v42.95,21.51 | v42.95,19.48 42.95,16.43 | C5.2 45.36,28.24 42.95,28.24 | C12.2 83.97,12.24 83.97,14.53 | v18.82,34.47 18.82,36.47 C33.2 | C29.2 16.79,23.36 16.79,22.02 | 16.79,22.02 v18.44,22.02
  Top 0.61: C7.+ 74.37,21.72 74.37,21.77
  Bottom 0.406: v84.73,21.77 76.48,21.77 | 76.48,21.77 v75.97,21.77 | 76.48,21.77 76.48,16.05 76.1,15.67 v60.73,15.67 v42.82,15.67 31.9,15.67 31.9,15.8 | 31.9,15.8 v31.65,20.24 19.2,20.24 19.2,22.02 v18.44,22.02 18.44,30.02 18.79,30.01 | v27.84,15.8 31.9,15.8 | v15.39,30.02 18.79,30.01 | v42.95,21.51 v42.95,19.48 | v18.82,34.47 18.79,30.01
LOADCELL1_SIG+
  Top 0.254: LC1.2 63.14,8.86 63.14,10.46 62.51,10.46 62.51,12.88 63.33,12.88 R17.2
LOADCELL1_SIG-
  Top 0.254: LC1.3 64.03,8.86 R30.2
LOADCELL2_SIG+
  Top 0.254: LC2.2 45.87,8.84 45.87,9.96 45.36,10.46 45.36,12.62 45.75,13 R31.2
LOADCELL2_SIG-
  Top 0.254: LC2.3 46.76,8.84 R32.2
LOADCELL3_SIG+
  Top 0.254: LC3.2 28.47,8.81 28.47,10.59 28.09,11.35 28.09,13.89 29.36,13.89 29.36,15.54 29.36,15.93 R37.2
LOADCELL3_SIG-
  Top 0.254: LC3.3 29.49,8.81 29.49,11.86 R38.2
LOADCELL4_SIG+
  Top 0.254: R35.2 12.73,19.23 11.46,17.96 11.46,14.78 11.07,13.77
  Top 0.406: 11.07,13.77 LC4.2
LOADCELL4_SIG-
  Top 0.254: R36.2 12.29,17.45 11.96,17.45 11.96,13.11 LC4.3
MISO  (via drill 0.5 pad 0.25, 0.6)
  Top 0.254: U1.23 36.17,29.9 38.25,29.9 38.25,30.91 46.38,30.91 46.38,31.55 49.3,31.55 v49.3,31.67 | v61.11,31.67 v61.11,35.61 | v67.72,58.47 72.42,58.47 72.42,61.14 72.8,61.14 RASPI_CONNECTOR_(TOP).21
  Bottom 0.254: v49.3,31.67 v61.11,31.67 | v61.11,35.61 61.11,48.82 66.95,48.82 66.95,56.69 67.72,57.2 v67.72,58.47
MOSI  (via drill 0.5 pad 0.25)
  Top 0.254: U1.24 36.15,30.53 37.62,30.53 37.62,32.18 v44.6,32.18 | v65.05,56.82 65.05,57.2 69.11,57.2 69.11,56.95 72.92,56.95 72.92,60.5 75.34,60.5 RASPI_CONNECTOR_(TOP).19
  Bottom 0.254: v44.6,32.18 48.03,32.18 48.03,37.77 51.33,37.77 51.33,43.36 55.52,43.36 55.52,44.37 59.84,44.37 59.84,51.1 65.05,51.1 v65.05,56.82
MOT_PWM  (via drill 0.5 pad 0.25)
  Top 0.254: POWR_BRD.3 39.4,79.68 39.4,60.88 43.84,60.88 43.84,52.5 47.78,52.5 47.78,52.37 49.68,52.37 v49.68,50.98 | v51.71,50.98 51.71,47.93 50.13,47.93 IC2.14
  Bottom 0.254: v49.68,50.98 v51.71,50.98
N$1  (via drill 0.6)
  Top 0.254: DISPLAY.2 53.06,82.3 51.84,81.08 v51.84,75.23 | v31.52,44.63 28.09,44.63 28.09,36.37 v28.98,36.37 | v55.4,33.07 v55.4,35.86 | v55.4,38.91 54.93,38.91 IC2.20
  Bottom 0.254: v51.84,75.23 46.13,75.23 46.13,69.27 42.44,69.27 42.44,65.07 31.52,65.07 v31.52,44.63 | v28.98,36.37 38.63,36.37 38.63,33.07 v55.4,33.07 | v55.4,35.86 v55.4,38.91
N$2
  Top 0.254: IC2.7 40.79,47 40.79,51.87 Q1.2 | Q1.2 40.59,54.36 | C3.1 35,52.37 39.9,52.37 Q1.2
N$3
  Top 0.406: R5.2 7.09,76.58 4.72,76.58 4.72,74.98 2.57,74.98 2.57,74.89 C4.1
N$5  (via drill 0.5 pad 0.25)
  Top 0.254: R38.1 31.52,11.86 31.65,12.37 33.3,12.37 C36.2 33.68,14.15 35.08,14.15 35.08,14.27 C34.1 35.59,13.77 35.59,12.62 39.27,12.62 v39.27,19.48 | v39.27,21.77 39.27,25.07 37.11,25.07 37.11,25.32 36.14,25.32 U1.16
  Bottom 0.254: v39.27,19.48 v39.27,21.77
N$7
  Top 0.254: IC2.8 40.79,46.2 40.79,45.14 | 40.79,45.14 40.79,43.36 40.59,43.36 Q1.1 | C14.1 34.93,45.14 40.79,45.14
N$8  (via drill 0.5 pad 0.25)
  Top 0.254: IC2.3 42.19,50.22 v42.19,59.49 | v46.76,65.96 v49.68,65.96 | v60.22,65.33 62.13,65.33 62.13,68.5 v67.97,68.5 | v69.88,69.52 v77.88,69.52
  Bottom 0.254: v42.19,59.49 43.21,59.49 43.21,65.96 v46.76,65.96 | v49.68,65.96 60.22,65.96 v60.22,65.33 | v67.97,68.5 69.88,68.5 v69.88,69.52 | v77.88,69.52 RASPI_CONNECTOR_(TOP).18
N$9  (via drill 0.5 pad 0.25)
  Top 0.254: R17.1 61.62,16.69 C21.1 62.26,16.69 C20.1 60.35,18.97 v60.35,19.1 | v27.08,27.36 27.08,26.59 30.5,26.59 U1.7
  Bottom 0.254: v60.35,19.1 55.78,19.1 55.78,26.72 40.28,26.72 40.28,27.36 29.36,27.23 29.49,27.1 27.46,27.1 v27.08,27.36
N$10
  Top 0.254: R4.2 85.75,37.45 85.75,37.77 51.71,37.77 51.71,42 IC2.16
N$11  (via drill 0.5 pad 0.25)
  Top 0.254: IC2.21 57.05,39.17 71.53,39.17 v71.53,54.66 | v71.27,59.36 v65.68,59.36 | v70.38,71.68 v70.38,73.96 | v68.1,77.65 68.1,82.35 DISPLAY.12
  Bottom 0.254: v71.53,54.66 71.53,57.2 71.27,57.2 v71.27,59.36 | v65.68,59.36 65.68,69.27 67.08,69.27 67.08,70.28 70.38,70.28 v70.38,71.68 | v70.38,73.96 68.1,73.96 v68.1,77.65
N$12
  Top 0.406: I2C.2 RASPI_CONNECTOR_(TOP).3
N$14
  Top 0.254: IC1.3 8.74,72.62 10.26,72.64 7.14,72.64 R1.2 7.37,74.45 R5.1
N$15  (via drill 0.5 pad 0.25)
  Top 0.254: IC2.22 57.68,39.8 69.11,39.8 v69.11,54.28 | v68.35,61.52 65.94,61.52 65.94,67.36 v63.4,67.36 | v65.94,72.06 65.94,74.6 DISPLAY.11
  Bottom 0.254: v69.11,54.28 69.11,59.36 68.35,59.36 v68.35,61.52 | v63.4,67.36 63.4,72.06 v65.94,72.06
N$16  (via drill 0.5 pad 0.25)
  Top 0.254: DISPLAY.10 62.13,81.08 v62.13,71.04 | v62.13,61.01 62.13,55.93 68.1,55.93 v68.1,56.31 | v67.46,47.68 67.46,43.87 IC2.23
  Bottom 0.254: v62.13,71.04 v62.13,61.01 | v68.1,56.31 68.1,55.55 67.46,55.55 v67.46,47.68
N$17  (via drill 0.5 pad 0.25)
  Top 0.254: DISPLAY.9 64.16,78.28 v64.16,71.3 | v63.14,62.03 63.14,57.45 62.89,57.45 v62.89,56.69 | v62.89,52.88 v62.89,47.42 | v62.89,44.63 IC2.24
  Bottom 0.254: v64.16,71.3 64.16,62.03 v63.14,62.03 | v62.89,56.69 v62.89,52.88 | v62.89,47.42 v62.89,44.63
N$18  (via drill 0.5 pad 0.25)
  Top 0.254: DISPLAY.8 60.88,82.35 59.72,81.2 59.72,78.03 58.83,78.03 58.83,60.63 v58.19,60.63 | v58.19,58.47 58.19,54.41 66.19,54.41 66.19,45.52 58.44,45.52 IC2.25
  Bottom 0.254: v58.19,60.63 v58.19,58.47
N$19  (via drill 0.5 pad 0.25)
  Top 0.254: DISPLAY.7 60.35,78.92 v60.35,67.36 | v60.6,63.55 v60.6,58.22 | v64.92,58.34 64.92,57.71 v70.38,57.71 | v70.38,54.28 v70.38,46.28 | v65.18,46.28 IC2.26
  Bottom 0.254: v60.35,67.36 61.11,67.36 61.11,64.31 60.6,64.31 v60.6,63.55 | v60.6,58.22 64.54,58.22 v64.92,58.34 | v70.38,57.71 v70.38,54.28 | v70.38,46.28 v65.18,46.28
N$21
  pour Bottom (isolate 0.305): 78.38,0.56 78.38,9.83 71.27,9.83 71.27,12.62 16.41,12.88 16.28,38.28 0.79,38.28 0.91,85.9 102.77,85.78 102.64,0.56
N$22
  Top 0.254: C16.1 15.38,69.34 IC1.5
  Top 0.61: C38.+ 18.21,68.3 C16.1
N$23
  Top 0.61: SP1.1 27.91,73.13 C38.-
N$24  (via drill 0.5 pad 0.25)
  Top 0.254: R31.1 43.97,16.43 C22.1 45.36,16.43 C23.1 v43.97,18.47 | v28.6,25.32 30.5,25.32 U1.9
  Bottom 0.254: v43.97,18.47 33.05,18.47 33.05,25.32 v28.6,25.32
N$27
  Top 0.254: C4.2 2.46,83.08 10.69,83.11 11.99,83.11 AIN_SIG.1
N$28
  pour Top (isolate 0.305): 0.66,38.02 0.79,85.52 0.79,85.9 102.77,85.9 102.51,0.69 78.26,0.69 78.26,9.96 70.76,9.96 70.51,12.75 26.06,12.75 26.06,17.45 17.3,17.45 17.3,18.08 16.66,18.08 16.66,38.02
N$32
  Top 0.254: R12.2 5.61,49.83 5.61,49.96 5.87,49.96 AT_RST.C
N$34
  Top 0.254: RPI_RST.C 82.96,29.21 R13.2
N$37  (via drill 0.5 pad 0.25)
  Top 0.254: IC2.40 51.84,53.72 51.84,57.45 53.24,57.45 53.24,58.72 v56.54,58.72 | v57.05,63.55 57.05,80.95 DISPLAY.6
  Bottom 0.254: v56.54,58.72 56.54,61.39 57.05,61.39 v57.05,63.55
N$38
  Top 0.254: IC2.41 50.95,53.63 50.95,58.47 52.48,58.47 52.48,59.74 56.29,59.74 56.29,61.01 57.43,61.01 57.43,62.41 58.34,62.41 DISPLAY.5
N$39  (via drill 0.5 pad 0.25)
  Top 0.254: IC2.42 50.19,53.67 v50.19,59.36 | v54.51,64.95 54.51,81.08 DISPLAY.4
  Bottom 0.254: v50.19,59.36 52.6,59.36 52.6,61.65 54.51,61.65 v54.51,64.95
N$41
  Top 0.254: IC2.43 49.43,53.7 49.43,61.65 55.8,61.67 DISPLAY.3
N$42  (via drill 0.5 pad 0.25)
  Top 0.254: 47.65,16.43 49.05,16.43 | 49.05,16.43 49.05,11.61 R32.1 | C22.2 47.65,16.43 | 47.65,16.43 C24.1 | U1.10 29.62,24.65 29.62,24.56 27.46,24.52 v27.46,24.69 | v49.05,17.32 49.05,16.43
  Bottom 0.254: v27.46,24.69 27.97,24.69 27.97,24.56 31.39,24.56 31.39,24.69 32.54,24.69 32.54,17.32 v49.05,17.32
N$43
  Top 0.254: IC2.44 48.54,53.61 48.54,63.3 53.26,63.32 DISPLAY.1
N$44  (via drill 0.5)
  Top 0.254: R34.1 19.89,27.79 20.85,27.79 20.85,27.74 C28.2 C27.1 23.52,27.53 23.52,23.29 v24.03,23.29 | U1.12 28.6,23.36 v28.6,23.29
  Bottom 0.254: v28.6,23.29 v24.03,23.29
N$45  (via drill 0.5)
  Top 0.254: R35.1 17.17,19.48 17.3,19.48 17.3,20.12 C32.1 18.44,20.24 19.46,20.24 19.46,23.16 C30.1 20.09,23.16 20.09,24.82 v21.49,24.82 | v38,25.83 37.62,25.96 U1.17
  Bottom 0.254: v21.49,24.82 21.49,26.09 37.62,26.09 v38,25.83
N$46  (via drill 0.5)
  Top 0.254: R36.1 17.81,17.45 C32.2 20.35,18.34 C31.1 v20.35,21.26 | v38.89,26.59 36.14,26.59 U1.18
  Bottom 0.254: v20.35,21.26 20.35,26.59 v38.89,26.59
N$47  (via drill 0.5 pad 0.25)
  Top 0.254: R37.1 31.01,15.93 C36.1 35.59,15.93 C35.1 35.84,17.7 v35.84,21.39 | v38.25,21.39 38.21,24.52 36.47,24.56 U1.15
  Bottom 0.254: v35.84,21.39 v38.25,21.39
N$48  (via drill 0.5 pad 0.25)
  Top 0.254: R30.1 65.56,16.69 C21.2 63.91,16.69 C19.1 v65.94,18.97 | v33.81,22.53 33.81,25.96 U1.8 | v54.64,22.53 v57.3,22.53
  Bottom 0.254: v65.94,18.97 65.81,18.97 65.81,22.53 v57.3,22.53 | v33.81,22.53 v54.64,22.53
N$50
  Top 0.406: I2C.1 RASPI_CONNECTOR_(TOP).5
N$51  (via drill 0.5 pad 0.25)
  Top 0.61: Q2.2 85.17,57.45 v85.24,57.71 | v100.61,57.71 100.61,74.14 FAN.2
  Bottom 0.61: v85.24,57.71 v100.61,57.71
N$52  (via drill 0.5 pad 0.25)
  Top 0.254: IC2.9 46.71,45.39 v43.71,45.39 | v61.37,56.69 61.37,63.04 64.67,63.04 64.67,60.25 68.99,60.25 68.99,60.12 v69.88,60.12 | v82.7,60.12 v85.12,60.12
  Bottom 0.254: v43.71,45.39 45.75,45.39 45.75,49.07 58.19,49.07 58.19,52.88 59.21,52.88 59.21,54.28 61.37,54.28 v61.37,56.69 | v69.88,60.12 v82.7,60.12 | v85.12,60.12 89.31,60.12 89.31,65.33 90.32,66.34 RASPI_CONNECTOR_(TOP).8
N$53  (via drill 0.5)
  Top 0.254: R33.1 19.76,29.44 C28.1 C26.1 23.39,29.44 v23.39,31.17 | v26.82,28.37 26.31,28.37 26.31,23.93 27.71,23.93 28.09,24.05 30.5,24.05 U1.11
  Bottom 0.254: v23.39,31.17 26.82,31.17 v26.82,28.37
N$54  (via drill 0.5 pad 0.25)
  Top 0.254: RASPI_CONNECTOR_(TOP).10 88.04,65.07 81.69,64.95 81.69,58.47 v74.07,58.47 | v72.8,54.15 v72.8,39.67 | v72.8,36.75 71.91,36.75 71.91,37.01 v47.02,37.01 | v47.02,40.56 v44.6,40.56 | v44.6,44.63 IC2.10
  Bottom 0.254: v74.07,58.47 74.07,56.31 72.8,56.31 v72.8,54.15 | v72.8,39.67 v72.8,36.75 | v47.02,37.01 v47.02,40.56 | v44.6,40.56 v44.6,44.63
N$55  (via drill 0.5 pad 0.25)
  Top 0.254: RASPI_CONNECTOR_(TOP).16 80.42,65.2 76.61,65.2 v76.61,61.14 | v71.15,61.14 69.24,61.14 69.24,60.76 65.43,60.76 65.43,65.84 v63.02,65.84 | v45.49,57.58 v45.49,55.17 | v43.71,50.98 IC2.2
  Bottom 0.254: v76.61,61.14 v71.15,61.14 | v63.02,65.84 62.64,65.84 62.64,69.9 62.89,69.9 62.89,71.93 48.29,71.93 48.29,61.14 45.49,61.14 v45.49,57.58 | v45.49,55.17 45.49,50.98 v43.71,50.98
N$56  (via drill 0.5 pad 0.25)
  Top 0.254: RASPI_CONNECTOR_(TOP).12 85.5,67.61 74.19,67.61 v74.07,67.23 | v44.6,58.09 v44.6,53.9 | v44.6,51.74 IC2.1
  Bottom 0.254: v74.07,67.23 74.07,73.08 47.78,73.08 47.78,62.92 44.6,62.92 v44.6,58.09 | v44.6,53.9 v44.6,51.74
N$58
  Top 0.406: RASPI_CONNECTOR_(TOP).2 99.59,66.34 99.59,54.28 T2.8
N$59  (via drill 0.5 pad 0.25)
  Top 0.254: C_CLOSE.1 70.13,76.76 67.34,76.76 67.34,70.03 v61.24,70.03 | v54.89,51.61 54.89,49.45 55.6,49.4 IC2.30
  Bottom 0.254: v61.24,70.03 61.24,68.76 61.62,68.76 61.62,62.41 59.72,62.41 59.59,56.95 56.54,56.95 56.54,52.76 54.89,52.76 v54.89,51.61
N$60  (via drill 0.5 pad 0.25)
  Top 0.254: C_LOCK.1 79.65,78.54 77.88,78.54 77.88,74.98 72.54,74.98 v72.54,71.93 | v61.24,50.22 58.94,50.2 IC2.31
  Bottom 0.254: v72.54,71.93 72.54,69.14 71.53,69.14 71.53,62.41 66.95,62.41 66.95,57.45 66.19,57.45 66.19,56.82 66.19,50.22 v61.24,50.22
N$61  (via drill 0.5 pad 0.25)
  Top 0.254: P_LOCK.1 75.84,75.74 69.24,75.74 v69.24,72.06 | v64.16,59.23 63.91,58.85 v63.91,56.69 | v60.73,51.99 60.73,50.98 59.11,51 IC2.32
  Bottom 0.254: v69.24,72.06 67.59,72.06 67.59,70.92 66.19,70.92 66.19,70.03 65.18,70.03 65.18,60.63 64.16,60.63 v64.16,59.23 | v63.91,56.69 63.91,51.99 v60.73,51.99
N$62
  Top 0.254: BUT2.1 R7.2 87.78,71.1 87.78,71.04 86.13,71.04 86.13,68.63 70.26,68.63 RASPI_CONNECTOR_(TOP).24
N$63
  Top 0.254: BUT3.1 R6.2 80.8,70.28 68.99,70.28 68.99,67.49 67.72,67.49 RASPI_CONNECTOR_(TOP).26
N$64
  Top 0.254: R39.2 96.55,68.12 72.8,68.12 RASPI_CONNECTOR_(TOP).22
N$65
  Top 0.254: R48.2 65.23,53.72 65.05,53.77 56.95,53.77 IC2.34
N$66
  Top 0.254: BUT1.1 96.42,73.96 96.42,71.42 97.31,71.42 97.31,71.17 R39.1 R45.2
  Top 0.406: R44.2 91.47,71.87 91.47,71.81 94.13,71.81 94.13,71.36 R45.2
N$71
  Top 0.254: T2.4 91.62,49.71 90.32,49.71 90.32,46.23 R47.2
N$72  (via drill 0.5 pad 0.25)
  Top 0.406: T2.5 v97.82,48.44 | v89.43,52.76 89.81,52.78 T2.2
  Top 0.61: R46.1 89.38,52.76 v89.43,52.76
  Bottom 0.406: v97.82,48.44 89.43,48.44 v89.43,52.76
N$77  (via drill 0.5 pad 0.25)
  Top 0.406: VALVE+PROXSW.2 88.16,78.28 84.86,78.28 84.86,70.15 v84.23,70.15 | v76.61,55.93 76.61,54.18 Q3.2
  Bottom 0.406: v84.23,70.15 84.23,57.33 76.61,57.33 v76.61,55.93
PGND
  Top 0.254: 42.44,8.43 43.08,5.51 50.19,5.89 50.44,8.31
  Top 1.676: 73.69,5.64 76.48,5.64 76.48,3.61 73.94,3.61 73.94,5.13 | 14.63,35.1 11.2,35.23 11.58,31.55 | 8.03,16.69 7.66,16.7 | 7.66,16.7 4.98,16.81 4.98,13.39 8.41,13.13 | 15.14,13.13 15.27,13.13 | 15.27,13.13 18.57,13.13 | 18.57,13.13 18.57,16.31 | 25.17,11.86 24.28,11.86 | 24.28,11.86 22,11.86 22,8.43 24.92,8.31 | 32.41,8.18 35.84,8.31 35.84,11.23 39.4,11.23 39.52,8.56 42.44,8.43 | 49.43,8.31 50.44,8.31 53.11,8.31 53.11,10.97 57.18,10.97 57.05,8.31 59.84,8.18 59.84,6.02 67.21,6.02 67.21,8.31 70.64,8.18 | 70.64,8.18 70.51,8.94 | 7.66,16.7 8.41,17.83 11.46,21.51 11.71,24.69 15.01,24.69 15.14,22.02 11.96,22.02 7.77,16.94 7.77,13 7.9,10.85 15.39,10.85 15.27,13.13 | 18.57,13.13 24.28,11.86 | 70.64,8.18 75.21,4.5 75.34,2.84
  Bottom 1.676: J3.2 75.21,7.92 | 75.08,4.75 75.21,3.73 75.97,4.11 76.1,5 74.7,5.13 74.45,4.11
  pour Top: 77.37,0.18 77.37,9.07 69.75,9.07 69.75,11.61 67.21,11.61 67.21,6.53 60.35,6.53 60.35,11.61 49.43,11.61 49.43,6.53 43.08,6.53 43.08,11.61 32.41,11.61 32.41,6.53 25.3,6.53 25.3,16.69 15.14,16.69 15.14,11.48 8.79,11.48 8.92,19.99 10.44,21.51 15.77,21.39 15.77,25.45 10.69,25.45 10.57,31.17 15.65,31.17 15.52,35.36 9.04,36.5 0.15,36.25 -0.1,0.18
  pour Bottom: 0.28,37.39 15.65,37.39 15.77,12.24 70.76,12.12 70.76,8.94 77.5,9.07 77.5,0.05 0.15,0.18
PRESS_SIG+
  Top 0.254: PRESS.2 12.31,28.63 15.65,28.63 16.79,29.51 16.84,29.95 R33.2
PRESS_SIG-
  Top 0.254: R34.2 17.02,27.86 13.11,27.86 PRESS.3
PROX_SWI  (via drill 0.5 pad 0.25)
  Top 0.254: v84.23,79.3 82.83,77.9 78.51,77.9 78.51,70.79 68.48,70.79 68.48,69.27 61.62,69.27 61.62,66.47 59.46,66.47 59.46,59.61 57.43,59.61 57.43,57.71 55.73,57.66 IC2.35
  Bottom 0.254: VALVE+PROXSW.3 90.7,79.3 v84.23,79.3
RPI_RST  (via drill 0.6)
  Top 0.254: IC2.37 54,53.6 54,48.56 54.38,48.56 v54.38,47.8 | v56.41,45.9 56.41,43.36 57.18,43.36 57.18,42.72 68.1,42.72 v68.1,41.33 | v78,41.33 78,44.5 90.37,44.5 R47.1 90.45,44.52 90.45,32.56 88.04,32.56 RPI_RST.A
  Bottom 0.254: v54.38,47.8 56.41,47.8 v56.41,45.9 | v68.1,41.33 v78,41.33
SAFETY_CHAIN  (via drill 0.5 pad 0.25)
  Top 0.254: POWR_BRD.11 50.95,78.16 50.95,64.95 47.27,64.95 v47.27,54.03 | v56.03,51.74 58.26,51.74 IC2.33
  Bottom 0.254: v47.27,54.03 52.6,54.03 52.6,50.72 56.03,50.72 v56.03,51.74
SCLK  (via drill 0.5 pad 0.25)
  Top 0.254: U1.1 30.48,30.53 v28.85,30.53
  Bottom 0.254: v28.85,30.53 28.85,31.67 43.21,31.67 43.21,36.37 46.13,36.37 46.13,41.71 50.83,41.71 50.83,43.87 55.02,43.87 55.02,45.01 58.83,45.01 58.83,52.25 59.84,52.25 59.84,53.52 62.13,53.52 62.13,57.58 65.68,57.58 65.68,58.34 66.45,58.34 66.45,65.07 70.26,65.07 RASPI_CONNECTOR_(TOP).23
TEMPER_SIG+  (via drill 0.5)
  Top 0.254: TEMP.1 12.6,42.6 12.6,37.77 17.17,37.77 17.17,33.45 26.95,33.45 26.95,32.99 | 26.95,32.99 v26.95,32.05 | v28.6,27.86 30,27.86 U1.5 | R2.2 26.95,32.99
  Bottom 0.254: v26.95,32.05 27.71,32.05 27.71,29.26 28.6,29.26 v28.6,27.86
VALVE_OPEN  (via drill 0.5 pad 0.25)
  Top 0.254: Q3.1 v78.89,55.68 | v68.35,53.39 68.35,51.74 67.21,51.74 R48.1
  Bottom 0.254: v78.89,55.68 77.88,55.68 77.88,54.79 73.69,54.79 73.69,53.39 v68.35,53.39

### Text on the board
tPlace: + | - | v | p | 12V / max / 1A | 1 | 1 | + | Safety / Switches | EveryCook.org/opensource
bPlace: user input | speaker / (bottom side) | EveryCook.org/opensource | pGND | 12V | 0V | 5V
tNames: connect cable with 3.5mm 90° angle jack